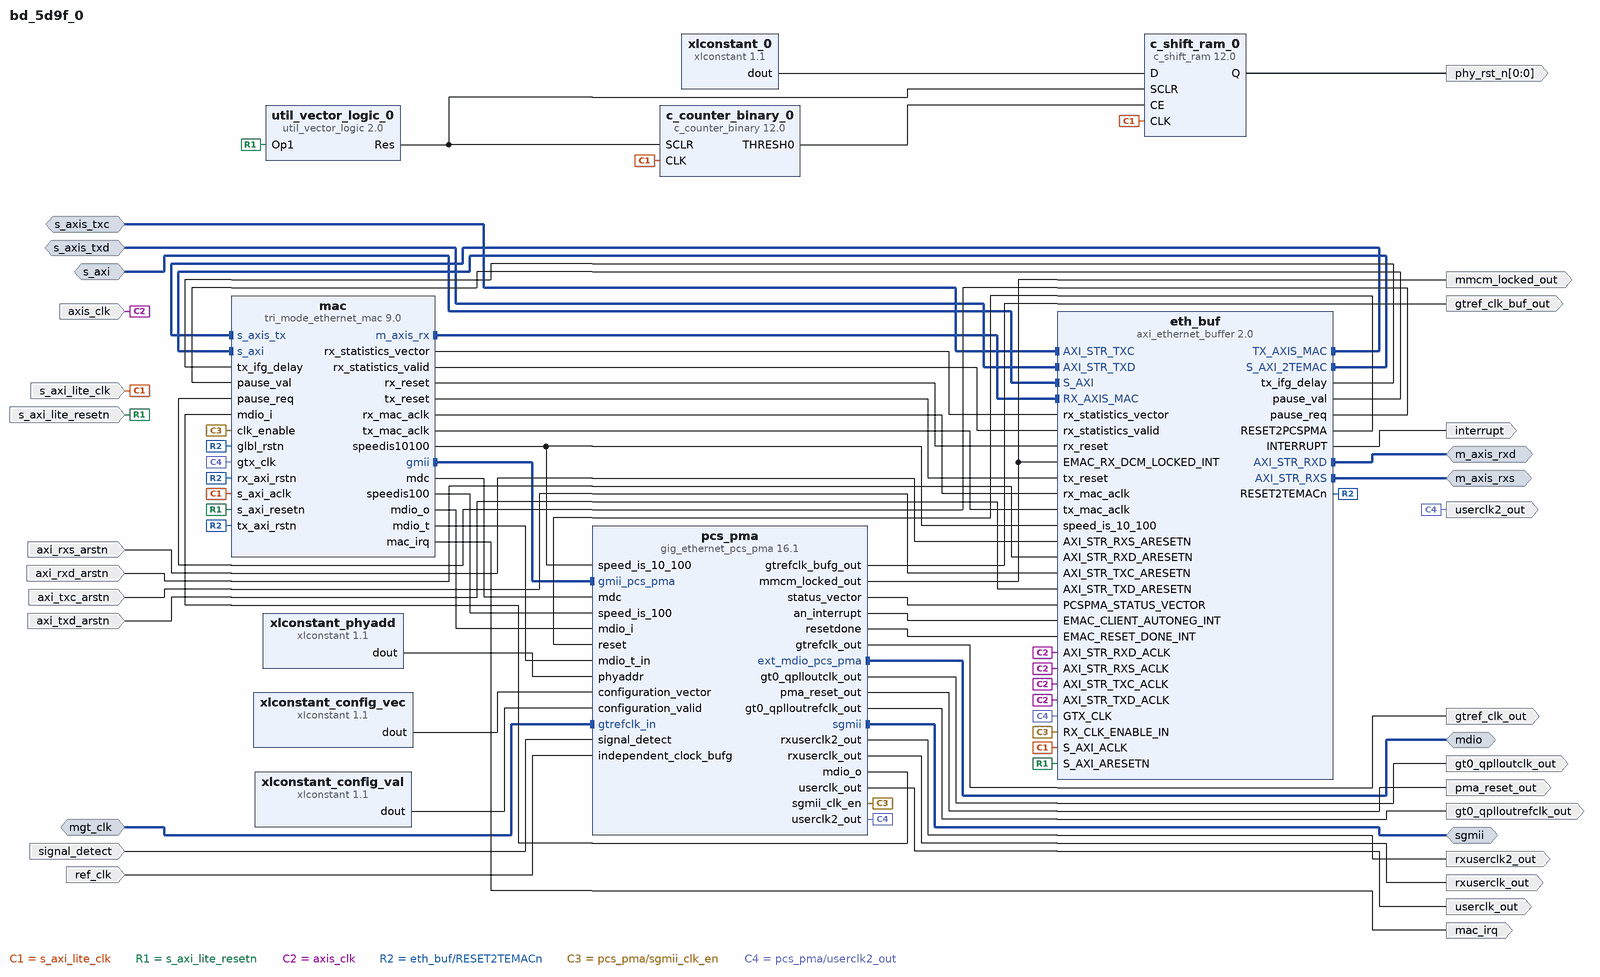
[diagram p0: block diagram of the top level]
# Vivado block design bd_5d9f_0, xc7vx485tffg1761-2, Vivado 2018.3
create_bd_design bd_5d9f_0

create_bd_intf_port -mode Slave -vlnv xilinx.com:interface:aximm_rtl:1.0 s_axi
set_property -dict {CONFIG.PROTOCOL AXI4LITE} [get_bd_intf_ports s_axi]
create_bd_intf_port -mode Slave -vlnv xilinx.com:interface:axis_rtl:1.0 s_axis_txd
create_bd_intf_port -mode Slave -vlnv xilinx.com:interface:axis_rtl:1.0 s_axis_txc
create_bd_intf_port -mode Master -vlnv xilinx.com:interface:axis_rtl:1.0 m_axis_rxd
create_bd_intf_port -mode Master -vlnv xilinx.com:interface:axis_rtl:1.0 m_axis_rxs
create_bd_intf_port -mode Master -vlnv xilinx.com:interface:mdio_rtl:1.0 mdio
create_bd_intf_port -mode Master -vlnv xilinx.com:interface:sgmii_rtl:1.0 sgmii
create_bd_intf_port -mode Slave -vlnv xilinx.com:interface:diff_clock_rtl:1.0 mgt_clk
set_property -dict {CONFIG.TYPE ETH_MGT_CLK} [get_bd_intf_ports mgt_clk]
create_bd_port -dir I -type rst s_axi_lite_resetn
set_property -dict {CONFIG.POLARITY ACTIVE_LOW} [get_bd_ports s_axi_lite_resetn]
create_bd_port -dir I -type clk s_axi_lite_clk
set_property -dict {CONFIG.ASSOCIATED_BUSIF s_axi CONFIG.ASSOCIATED_RESET s_axi_lite_resetn} [get_bd_ports s_axi_lite_clk]
create_bd_port -dir O -type intr mac_irq
set_property -dict {CONFIG.SENSITIVITY EDGE_RISING} [get_bd_ports mac_irq]
create_bd_port -dir I -type clk axis_clk
set_property -dict [list \
  CONFIG.ASSOCIATED_BUSIF m_axis_rxd:m_axis_rxs:s_axis_txc:s_axis_txd \
  CONFIG.ASSOCIATED_RESET axi_rxd_arstn:axi_rxs_arstn:axi_txc_arstn:axi_txd_arstn \
] [get_bd_ports axis_clk]
create_bd_port -dir I -type rst axi_txd_arstn
set_property -dict {CONFIG.POLARITY ACTIVE_LOW} [get_bd_ports axi_txd_arstn]
create_bd_port -dir I -type rst axi_txc_arstn
set_property -dict {CONFIG.POLARITY ACTIVE_LOW} [get_bd_ports axi_txc_arstn]
create_bd_port -dir I -type rst axi_rxd_arstn
set_property -dict {CONFIG.POLARITY ACTIVE_LOW} [get_bd_ports axi_rxd_arstn]
create_bd_port -dir I -type rst axi_rxs_arstn
set_property -dict {CONFIG.POLARITY ACTIVE_LOW} [get_bd_ports axi_rxs_arstn]
create_bd_port -dir O -type intr interrupt
set_property -dict {CONFIG.SENSITIVITY LEVEL_HIGH} [get_bd_ports interrupt]
create_bd_port -dir I signal_detect
create_bd_port -dir O mmcm_locked_out
create_bd_port -dir O -type clk rxuserclk_out
set_property -dict {CONFIG.FREQ_HZ 62500000} [get_bd_ports rxuserclk_out]
create_bd_port -dir O -type clk rxuserclk2_out
set_property -dict {CONFIG.FREQ_HZ 62500000} [get_bd_ports rxuserclk2_out]
create_bd_port -dir O -type clk userclk_out
set_property -dict {CONFIG.FREQ_HZ 62500000} [get_bd_ports userclk_out]
create_bd_port -dir O -type clk userclk2_out
set_property -dict {CONFIG.FREQ_HZ 125000000} [get_bd_ports userclk2_out]
create_bd_port -dir O -type rst pma_reset_out
set_property -dict {CONFIG.POLARITY ACTIVE_HIGH} [get_bd_ports pma_reset_out]
create_bd_port -dir O -type clk gt0_qplloutclk_out
create_bd_port -dir O -type clk gt0_qplloutrefclk_out
create_bd_port -dir O -from 0 -to 0 -type rst phy_rst_n
set_property -dict {CONFIG.POLARITY ACTIVE_LOW} [get_bd_ports phy_rst_n]
create_bd_port -dir I -type clk ref_clk
set_property -dict {CONFIG.FREQ_HZ 200000000} [get_bd_ports ref_clk]
create_bd_port -dir O -type clk gtref_clk_out
set_property -dict {CONFIG.FREQ_HZ 125000000} [get_bd_ports gtref_clk_out]
create_bd_port -dir O -type clk gtref_clk_buf_out
set_property -dict {CONFIG.FREQ_HZ 125000000} [get_bd_ports gtref_clk_buf_out]

create_bd_cell -type ip -vlnv xilinx.com:ip:axi_ethernet_buffer:2.0 eth_buf
set_property -dict [list \
  CONFIG.C_AVB 0 \
  CONFIG.C_PHYADDR 7 \
  CONFIG.C_PHY_TYPE 4 \
  CONFIG.C_STATS 1 \
  CONFIG.C_TYPE 1 \
  CONFIG.ENABLE_LVDS 0 \
  CONFIG.HAS_SGMII true \
  CONFIG.MCAST_EXTEND false \
  CONFIG.PHYRST_BOARD_INTERFACE phy_reset_out \
  CONFIG.RXCSUM None \
  CONFIG.RXMEM 4k \
  CONFIG.RXVLAN_STRP false \
  CONFIG.RXVLAN_TAG false \
  CONFIG.RXVLAN_TRAN false \
  CONFIG.SIMULATION_MODE false \
  CONFIG.TXCSUM None \
  CONFIG.TXMEM 4k \
  CONFIG.TXVLAN_STRP false \
  CONFIG.TXVLAN_TAG false \
  CONFIG.TXVLAN_TRAN false \
  CONFIG.USE_BOARD_FLOW true \
  CONFIG.enable_1588 0 \
] [get_bd_cells eth_buf]
create_bd_cell -type ip -vlnv xilinx.com:ip:tri_mode_ethernet_mac:9.0 mac
set_property -dict [list \
  CONFIG.Data_Rate 1_Gbps \
  CONFIG.ETHERNET_BOARD_INTERFACE Custom \
  CONFIG.Enable_1588 false \
  CONFIG.Enable_AVB false \
  CONFIG.Enable_MDIO true \
  CONFIG.Enable_Priority_Flow_Control false \
  CONFIG.Frame_Filter true \
  CONFIG.Int_Mode_Type SGMII \
  CONFIG.MAC_Speed Tri_speed \
  CONFIG.MDIO_BOARD_INTERFACE Custom \
  CONFIG.Make_MDIO_External false \
  CONFIG.Management_Interface true \
  CONFIG.Number_of_Table_Entries 4 \
  CONFIG.Physical_Interface Internal \
  CONFIG.Statistics_Counters true \
  CONFIG.Statistics_Reset true \
  CONFIG.Statistics_Width 64bit \
  CONFIG.USE_BOARD_FLOW FALSE \
] [get_bd_cells mac]
create_bd_cell -type ip -vlnv xilinx.com:ip:gig_ethernet_pcs_pma:16.1 pcs_pma
set_property -dict [list \
  CONFIG.Auto_Negotiation TRUE \
  CONFIG.ClockSelection Sync \
  CONFIG.DIFFCLK_BOARD_INTERFACE sgmii_mgt_clk \
  CONFIG.DrpClkRate 50.0 \
  CONFIG.ETHERNET_BOARD_INTERFACE sgmii \
  CONFIG.EXAMPLE_SIMULATION 0 \
  CONFIG.EnableAsyncSGMII false \
  CONFIG.Enable_1588 false \
  CONFIG.GT_Location X0Y0 \
  CONFIG.GT_Type GTH \
  CONFIG.GTinEx false \
  CONFIG.InstantiateBitslice0 false \
  CONFIG.LvdsRefClk 125 \
  CONFIG.MDIO_BOARD_INTERFACE mdio_mdc \
  CONFIG.Management_Interface TRUE \
  CONFIG.MaxDataRate 1G \
  CONFIG.NumOfLanes 1 \
  CONFIG.RefClkRate 125 \
  CONFIG.RefClkSrc clk0 \
  CONFIG.RxLane0_Placement DIFF_PAIR_0 \
  CONFIG.RxNibbleBitslice0Used false \
  CONFIG.SGMII_Mode 10_100_1000 \
  CONFIG.SGMII_PHY_Mode FALSE \
  CONFIG.SupportLevel Include_Shared_Logic_in_Core \
  CONFIG.TransceiverControl false \
  CONFIG.TxLane0_Placement DIFF_PAIR_0 \
  CONFIG.Tx_In_Upper_Nibble 1 \
  CONFIG.USE_BOARD_FLOW true \
] [get_bd_cells pcs_pma]
create_bd_cell -type ip -vlnv xilinx.com:ip:xlconstant:1.1 xlconstant_phyadd
set_property -dict {CONFIG.CONST_VAL 7 CONFIG.CONST_WIDTH 5} [get_bd_cells xlconstant_phyadd]
create_bd_cell -type ip -vlnv xilinx.com:ip:xlconstant:1.1 xlconstant_config_vec
set_property -dict {CONFIG.CONST_VAL 16 CONFIG.CONST_WIDTH 5} [get_bd_cells xlconstant_config_vec]
create_bd_cell -type ip -vlnv xilinx.com:ip:xlconstant:1.1 xlconstant_config_val
set_property -dict {CONFIG.CONST_VAL 1 CONFIG.CONST_WIDTH 1} [get_bd_cells xlconstant_config_val]
create_bd_cell -type ip -vlnv xilinx.com:ip:c_shift_ram:12.0 c_shift_ram_0
set_property -dict [list \
  CONFIG.AsyncInitVal 0 \
  CONFIG.CE true \
  CONFIG.DefaultData 0 \
  CONFIG.Depth 1 \
  CONFIG.SCLR true \
  CONFIG.Width 1 \
] [get_bd_cells c_shift_ram_0]
create_bd_cell -type ip -vlnv xilinx.com:ip:c_counter_binary:12.0 c_counter_binary_0
set_property -dict [list \
  CONFIG.Final_Count_Value 300000 \
  CONFIG.Increment_Value 1 \
  CONFIG.Output_Width 24 \
  CONFIG.Restrict_Count true \
  CONFIG.SCLR true \
  CONFIG.Sync_Threshold_Output true \
  CONFIG.Threshold_Value 300000 \
] [get_bd_cells c_counter_binary_0]
create_bd_cell -type ip -vlnv xilinx.com:ip:xlconstant:1.1 xlconstant_0
create_bd_cell -type ip -vlnv xilinx.com:ip:util_vector_logic:2.0 util_vector_logic_0
set_property -dict {CONFIG.C_OPERATION not CONFIG.C_SIZE 1} [get_bd_cells util_vector_logic_0]

# ---- connections ----

connect_bd_intf_net [get_bd_intf_pins mac/gmii] [get_bd_intf_pins pcs_pma/gmii_pcs_pma]
connect_bd_intf_net [get_bd_intf_ports sgmii] [get_bd_intf_pins pcs_pma/sgmii]
connect_bd_intf_net [get_bd_intf_ports mdio] [get_bd_intf_pins pcs_pma/ext_mdio_pcs_pma]
connect_bd_intf_net [get_bd_intf_ports mgt_clk] [get_bd_intf_pins pcs_pma/gtrefclk_in]
connect_bd_intf_net [get_bd_intf_ports s_axis_txc] [get_bd_intf_pins eth_buf/AXI_STR_TXC]
connect_bd_intf_net [get_bd_intf_ports m_axis_rxd] [get_bd_intf_pins eth_buf/AXI_STR_RXD]
connect_bd_intf_net [get_bd_intf_ports s_axis_txd] [get_bd_intf_pins eth_buf/AXI_STR_TXD]
connect_bd_intf_net [get_bd_intf_ports m_axis_rxs] [get_bd_intf_pins eth_buf/AXI_STR_RXS]
connect_bd_intf_net [get_bd_intf_pins eth_buf/TX_AXIS_MAC] [get_bd_intf_pins mac/s_axis_tx]
connect_bd_intf_net [get_bd_intf_pins eth_buf/S_AXI_2TEMAC] [get_bd_intf_pins mac/s_axi]
connect_bd_intf_net [get_bd_intf_pins eth_buf/RX_AXIS_MAC] [get_bd_intf_pins mac/m_axis_rx]
connect_bd_intf_net [get_bd_intf_ports s_axi] [get_bd_intf_pins eth_buf/S_AXI]
connect_bd_net [get_bd_pins c_counter_binary_0/THRESH0] [get_bd_pins c_shift_ram_0/CE]
connect_bd_net [get_bd_pins xlconstant_0/dout] [get_bd_pins c_shift_ram_0/D]
connect_bd_net [get_bd_pins util_vector_logic_0/Res] [get_bd_pins c_shift_ram_0/SCLR] [get_bd_pins c_counter_binary_0/SCLR]
connect_bd_net [get_bd_ports s_axi_lite_clk] \
  [get_bd_pins c_shift_ram_0/CLK] [get_bd_pins c_counter_binary_0/CLK] [get_bd_pins eth_buf/S_AXI_ACLK] \
  [get_bd_pins mac/s_axi_aclk]
connect_bd_net [get_bd_pins c_shift_ram_0/Q] [get_bd_ports phy_rst_n]
connect_bd_net [get_bd_ports s_axi_lite_resetn] \
  [get_bd_pins util_vector_logic_0/Op1] [get_bd_pins eth_buf/S_AXI_ARESETN] [get_bd_pins mac/s_axi_resetn]
connect_bd_net [get_bd_ports axi_rxs_arstn] [get_bd_pins eth_buf/AXI_STR_RXS_ARESETN]
connect_bd_net [get_bd_ports axi_rxd_arstn] [get_bd_pins eth_buf/AXI_STR_RXD_ARESETN]
connect_bd_net [get_bd_ports axi_txc_arstn] [get_bd_pins eth_buf/AXI_STR_TXC_ARESETN]
connect_bd_net [get_bd_ports axi_txd_arstn] [get_bd_pins eth_buf/AXI_STR_TXD_ARESETN]
connect_bd_net [get_bd_ports axis_clk] \
  [get_bd_pins eth_buf/AXI_STR_RXS_ACLK] [get_bd_pins eth_buf/AXI_STR_RXD_ACLK] [get_bd_pins eth_buf/AXI_STR_TXC_ACLK] \
  [get_bd_pins eth_buf/AXI_STR_TXD_ACLK]
connect_bd_net [get_bd_pins mac/rx_statistics_vector] [get_bd_pins eth_buf/rx_statistics_vector]
connect_bd_net [get_bd_pins mac/rx_statistics_valid] [get_bd_pins eth_buf/rx_statistics_valid]
connect_bd_net [get_bd_pins eth_buf/tx_ifg_delay] [get_bd_pins mac/tx_ifg_delay]
connect_bd_net [get_bd_pins eth_buf/pause_val] [get_bd_pins mac/pause_val]
connect_bd_net [get_bd_pins eth_buf/pause_req] [get_bd_pins mac/pause_req]
connect_bd_net [get_bd_pins mac/rx_reset] [get_bd_pins eth_buf/rx_reset]
connect_bd_net [get_bd_pins mac/tx_reset] [get_bd_pins eth_buf/tx_reset]
connect_bd_net [get_bd_pins mac/rx_mac_aclk] [get_bd_pins eth_buf/rx_mac_aclk]
connect_bd_net [get_bd_pins mac/tx_mac_aclk] [get_bd_pins eth_buf/tx_mac_aclk]
connect_bd_net [get_bd_pins eth_buf/RESET2TEMACn] [get_bd_pins mac/glbl_rstn] [get_bd_pins mac/rx_axi_rstn] [get_bd_pins mac/tx_axi_rstn]
connect_bd_net [get_bd_pins eth_buf/INTERRUPT] [get_bd_ports interrupt]
connect_bd_net [get_bd_pins mac/mac_irq] [get_bd_ports mac_irq]
connect_bd_net [get_bd_ports signal_detect] [get_bd_pins pcs_pma/signal_detect]
connect_bd_net [get_bd_pins xlconstant_phyadd/dout] [get_bd_pins pcs_pma/phyaddr]
connect_bd_net [get_bd_pins xlconstant_config_vec/dout] [get_bd_pins pcs_pma/configuration_vector]
connect_bd_net [get_bd_pins xlconstant_config_val/dout] [get_bd_pins pcs_pma/configuration_valid]
connect_bd_net [get_bd_pins mac/mdc] [get_bd_pins pcs_pma/mdc]
connect_bd_net [get_bd_pins mac/speedis10100] [get_bd_pins eth_buf/speed_is_10_100] [get_bd_pins pcs_pma/speed_is_10_100]
connect_bd_net [get_bd_pins pcs_pma/status_vector] [get_bd_pins eth_buf/PCSPMA_STATUS_VECTOR]
connect_bd_net [get_bd_pins pcs_pma/an_interrupt] [get_bd_pins eth_buf/EMAC_CLIENT_AUTONEG_INT]
connect_bd_net [get_bd_pins mac/speedis100] [get_bd_pins pcs_pma/speed_is_100]
connect_bd_net [get_bd_pins pcs_pma/sgmii_clk_en] [get_bd_pins mac/clk_enable] [get_bd_pins eth_buf/RX_CLK_ENABLE_IN]
connect_bd_net [get_bd_pins eth_buf/RESET2PCSPMA] [get_bd_pins pcs_pma/reset]
connect_bd_net [get_bd_pins mac/mdio_o] [get_bd_pins pcs_pma/mdio_i]
connect_bd_net [get_bd_pins mac/mdio_t] [get_bd_pins pcs_pma/mdio_t_in]
connect_bd_net [get_bd_pins pcs_pma/mdio_o] [get_bd_pins mac/mdio_i]
connect_bd_net [get_bd_pins pcs_pma/resetdone] [get_bd_pins eth_buf/EMAC_RESET_DONE_INT]
connect_bd_net [get_bd_ports ref_clk] [get_bd_pins pcs_pma/independent_clock_bufg]
connect_bd_net [get_bd_pins pcs_pma/gtrefclk_bufg_out] [get_bd_ports gtref_clk_buf_out]
connect_bd_net [get_bd_pins pcs_pma/userclk2_out] [get_bd_pins eth_buf/GTX_CLK] [get_bd_ports userclk2_out] [get_bd_pins mac/gtx_clk]
connect_bd_net [get_bd_pins pcs_pma/gtrefclk_out] [get_bd_ports gtref_clk_out]
connect_bd_net [get_bd_pins pcs_pma/mmcm_locked_out] [get_bd_ports mmcm_locked_out] [get_bd_pins eth_buf/EMAC_RX_DCM_LOCKED_INT]
connect_bd_net [get_bd_pins pcs_pma/pma_reset_out] [get_bd_ports pma_reset_out]
connect_bd_net [get_bd_pins pcs_pma/rxuserclk2_out] [get_bd_ports rxuserclk2_out]
connect_bd_net [get_bd_pins pcs_pma/rxuserclk_out] [get_bd_ports rxuserclk_out]
connect_bd_net [get_bd_pins pcs_pma/userclk_out] [get_bd_ports userclk_out]
connect_bd_net [get_bd_pins pcs_pma/gt0_qplloutclk_out] [get_bd_ports gt0_qplloutclk_out]
connect_bd_net [get_bd_pins pcs_pma/gt0_qplloutrefclk_out] [get_bd_ports gt0_qplloutrefclk_out]

# ---- address map ----
assign_bd_address -offset 0x00000 -range 128K -target_address_space [get_bd_addr_spaces eth_buf/S_AXI_2TEMAC] [get_bd_addr_segs mac/s_axi/Reg]
assign_bd_address -offset 0x00000 -range 256K -target_address_space [get_bd_addr_spaces s_axi] [get_bd_addr_segs eth_buf/S_AXI/Reg]

validate_bd_design
save_bd_design
